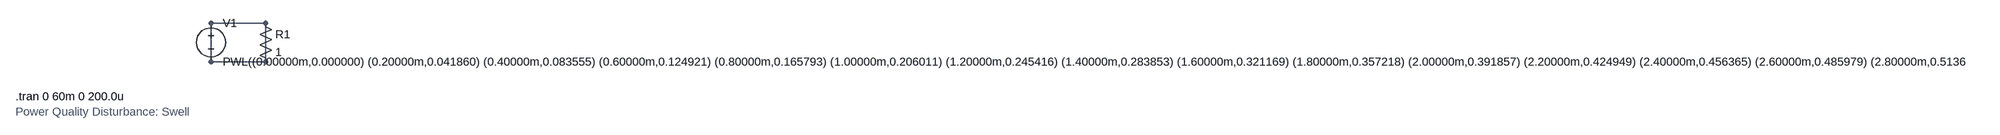
[diagram p0: schematic Swell.asc]
Swell.asc, the LTspice schematic file:
Version 4
SHEET 1 880 680
WIRE 192 128 80 128
WIRE 80 128 80 208
WIRE 192 208 80 208
WIRE 192 128 192 208
SYMBOL voltage 80 112 R0
WINDOW 123 0 0 Left 0
WINDOW 39 0 0 Left 0
SYMATTR InstName V1
SYMATTR Value PWL((0.00000m,0.000000) (0.20000m,0.041860) (0.40000m,0.083555) (0.60000m,0.124921) (0.80000m,0.165793) (1.00000m,0.206011) (1.20000m,0.245416) (1.40000m,0.283853) (1.60000m,0.321169) (1.80000m,0.357218) (2.00000m,0.391857) (2.20000m,0.424949) (2.40000m,0.456365) (2.60000m,0.485979) (2.80000m,0.513675) (3.00000m,0.539345) (3.20000m,0.562885) (3.40000m,0.584204) (3.60000m,0.603218) (3.80000m,0.619851) (4.00000m,0.634038) (4.20000m,0.645722) (4.40000m,0.654858) (4.60000m,0.661410) (4.80000m,0.665351) (5.00000m,0.666667) (5.20000m,0.665351) (5.40000m,0.661410) (5.60000m,0.654858) (5.80000m,0.645722) (6.00000m,0.634038) (6.20000m,0.619851) (6.40000m,0.603218) (6.60000m,0.584204) (6.80000m,0.562885) (7.00000m,0.539345) (7.20000m,0.513675) (7.40000m,0.485979) (7.60000m,0.456365) (7.80000m,0.424949) (8.00000m,0.391857) (8.20000m,0.357218) (8.40000m,0.321169) (8.60000m,0.283853) (8.80000m,0.245416) (9.00000m,0.206011) (9.20000m,0.165793) (9.40000m,0.124921) (9.60000m,0.083555) (9.80000m,0.041860) (10.00000m,0.000000) (10.20000m,-0.041860) (10.40000m,-0.083555) (10.60000m,-0.124921) (10.80000m,-0.165793) (11.00000m,-0.206011) (11.20000m,-0.245416) (11.40000m,-0.283853) (11.60000m,-0.321169) (11.80000m,-0.357218) (12.00000m,-0.391857) (12.20000m,-0.424949) (12.40000m,-0.456365) (12.60000m,-0.485979) (12.80000m,-0.513675) (13.00000m,-0.539345) (13.20000m,-0.562885) (13.40000m,-0.584204) (13.60000m,-0.603218) (13.80000m,-0.619851) (14.00000m,-0.634038) (14.20000m,-0.645722) (14.40000m,-0.654858) (14.60000m,-0.661410) (14.80000m,-0.665351) (15.00000m,-0.666667) (15.20000m,-0.665351) (15.40000m,-0.661410) (15.60000m,-0.654858) (15.80000m,-0.645722) (16.00000m,-0.634038) (16.20000m,-0.619851) (16.40000m,-0.603218) (16.60000m,-0.584204) (16.80000m,-0.562885) (17.00000m,-0.539345) (17.20000m,-0.513675) (17.40000m,-0.485979) (17.60000m,-0.456365) (17.80000m,-0.424949) (18.00000m,-0.391857) (18.20000m,-0.357218) (18.40000m,-0.321169) (18.60000m,-0.283853) (18.80000m,-0.245416) (19.00000m,-0.206011) (19.20000m,-0.165793) (19.40000m,-0.124921) (19.60000m,-0.083555) (19.80000m,-0.041860) (20.00000m,-0.000000) (20.20000m,0.062791) (20.40000m,0.125333) (20.60000m,0.187381) (20.80000m,0.248690) (21.00000m,0.309017) (21.20000m,0.368125) (21.40000m,0.425779) (21.60000m,0.481754) (21.80000m,0.535827) (22.00000m,0.587785) (22.20000m,0.637424) (22.40000m,0.684547) (22.60000m,0.728969) (22.80000m,0.770513) (23.00000m,0.809017) (23.20000m,0.844328) (23.40000m,0.876307) (23.60000m,0.904827) (23.80000m,0.929776) (24.00000m,0.951057) (24.20000m,0.968583) (24.40000m,0.982287) (24.60000m,0.992115) (24.80000m,0.998027) (25.00000m,1.000000) (25.20000m,0.998027) (25.40000m,0.992115) (25.60000m,0.982287) (25.80000m,0.968583) (26.00000m,0.951057) (26.20000m,0.929776) (26.40000m,0.904827) (26.60000m,0.876307) (26.80000m,0.844328) (27.00000m,0.809017) (27.20000m,0.770513) (27.40000m,0.728969) (27.60000m,0.684547) (27.80000m,0.637424) (28.00000m,0.587785) (28.20000m,0.535827) (28.40000m,0.481754) (28.60000m,0.425779) (28.80000m,0.368125) (29.00000m,0.309017) (29.20000m,0.248690) (29.40000m,0.187381) (29.60000m,0.125333) (29.80000m,0.062791) (30.00000m,0.000000) (30.20000m,-0.062791) (30.40000m,-0.125333) (30.60000m,-0.187381) (30.80000m,-0.248690) (31.00000m,-0.309017) (31.20000m,-0.368125) (31.40000m,-0.425779) (31.60000m,-0.481754) (31.80000m,-0.535827) (32.00000m,-0.587785) (32.20000m,-0.637424) (32.40000m,-0.684547) (32.60000m,-0.728969) (32.80000m,-0.770513) (33.00000m,-0.809017) (33.20000m,-0.844328) (33.40000m,-0.876307) (33.60000m,-0.904827) (33.80000m,-0.929776) (34.00000m,-0.951057) (34.20000m,-0.968583) (34.40000m,-0.982287) (34.60000m,-0.992115) (34.80000m,-0.998027) (35.00000m,-1.000000) (35.20000m,-0.998027) (35.40000m,-0.992115) (35.60000m,-0.982287) (35.80000m,-0.968583) (36.00000m,-0.951057) (36.20000m,-0.929776) (36.40000m,-0.904827) (36.60000m,-0.876307) (36.80000m,-0.844328) (37.00000m,-0.809017) (37.20000m,-0.770513) (37.40000m,-0.728969) (37.60000m,-0.684547) (37.80000m,-0.637424) (38.00000m,-0.587785) (38.20000m,-0.535827) (38.40000m,-0.481754) (38.60000m,-0.425779) (38.80000m,-0.368125) (39.00000m,-0.309017) (39.20000m,-0.248690) (39.40000m,-0.187381) (39.60000m,-0.125333) (39.80000m,-0.062791) (40.00000m,-0.000000) (40.20000m,0.041860) (40.40000m,0.083555) (40.60000m,0.124921) (40.80000m,0.165793) (41.00000m,0.206011) (41.20000m,0.245416) (41.40000m,0.283853) (41.60000m,0.321169) (41.80000m,0.357218) (42.00000m,0.391857) (42.20000m,0.424949) (42.40000m,0.456365) (42.60000m,0.485979) (42.80000m,0.513675) (43.00000m,0.539345) (43.20000m,0.562885) (43.40000m,0.584204) (43.60000m,0.603218) (43.80000m,0.619851) (44.00000m,0.634038) (44.20000m,0.645722) (44.40000m,0.654858) (44.60000m,0.661410) (44.80000m,0.665351) (45.00000m,0.666667) (45.20000m,0.665351) (45.40000m,0.661410) (45.60000m,0.654858) (45.80000m,0.645722) (46.00000m,0.634038) (46.20000m,0.619851) (46.40000m,0.603218) (46.60000m,0.584204) (46.80000m,0.562885) (47.00000m,0.539345) (47.20000m,0.513675) (47.40000m,0.485979) (47.60000m,0.456365) (47.80000m,0.424949) (48.00000m,0.391857) (48.20000m,0.357218) (48.40000m,0.321169) (48.60000m,0.283853) (48.80000m,0.245416) (49.00000m,0.206011) (49.20000m,0.165793) (49.40000m,0.124921) (49.60000m,0.083555) (49.80000m,0.041860) (50.00000m,0.000000) (50.20000m,-0.041860) (50.40000m,-0.083555) (50.60000m,-0.124921) (50.80000m,-0.165793) (51.00000m,-0.206011) (51.20000m,-0.245416) (51.40000m,-0.283853) (51.60000m,-0.321169) (51.80000m,-0.357218) (52.00000m,-0.391857) (52.20000m,-0.424949) (52.40000m,-0.456365) (52.60000m,-0.485979) (52.80000m,-0.513675) (53.00000m,-0.539345) (53.20000m,-0.562885) (53.40000m,-0.584204) (53.60000m,-0.603218) (53.80000m,-0.619851) (54.00000m,-0.634038) (54.20000m,-0.645722) (54.40000m,-0.654858) (54.60000m,-0.661410) (54.80000m,-0.665351) (55.00000m,-0.666667) (55.20000m,-0.665351) (55.40000m,-0.661410) (55.60000m,-0.654858) (55.80000m,-0.645722) (56.00000m,-0.634038) (56.20000m,-0.619851) (56.40000m,-0.603218) (56.60000m,-0.584204) (56.80000m,-0.562885) (57.00000m,-0.539345) (57.20000m,-0.513675) (57.40000m,-0.485979) (57.60000m,-0.456365) (57.80000m,-0.424949) (58.00000m,-0.391857) (58.20000m,-0.357218) (58.40000m,-0.321169) (58.60000m,-0.283853) (58.80000m,-0.245416) (59.00000m,-0.206011) (59.20000m,-0.165793) (59.40000m,-0.124921) (59.60000m,-0.083555) (59.80000m,-0.041860))
SYMBOL res 176 112 R0
SYMATTR InstName R1
SYMATTR Value 1
TEXT -320 280 Left 2 !.tran 0 60m 0 200.0u
TEXT -320 312 Left 2 ;Power Quality Disturbance: Swell

The netlist it stands for:
* Swell.asc
V1 N001 N001 PWL((0.00000m,0.000000) (0.20000m,0.041860) (0.40000m,0.083555) (0.60000m,0.124921) (0.80000m,0.165793) (1.00000m,0.206011) (1.20000m,0.245416) (1.40000m,0.283853) (1.60000m,0.321169) (1.80000m,0.357218) (2.00000m,0.391857) (2.20000m,0.424949) (2.40000m,0.456365) (2.60000m,0.485979) (2.80000m,0.513675) (3.00000m,0.539345) (3.20000m,0.562885) (3.40000m,0.584204) (3.60000m,0.603218) (3.80000m,0.619851) (4.00000m,0.634038) (4.20000m,0.645722) (4.40000m,0.654858) (4.60000m,0.661410) (4.80000m,0.665351) (5.00000m,0.666667) (5.20000m,0.665351) (5.40000m,0.661410) (5.60000m,0.654858) (5.80000m,0.645722) (6.00000m,0.634038) (6.20000m,0.619851) (6.40000m,0.603218) (6.60000m,0.584204) (6.80000m,0.562885) (7.00000m,0.539345) (7.20000m,0.513675) (7.40000m,0.485979) (7.60000m,0.456365) (7.80000m,0.424949) (8.00000m,0.391857) (8.20000m,0.357218) (8.40000m,0.321169) (8.60000m,0.283853) (8.80000m,0.245416) (9.00000m,0.206011) (9.20000m,0.165793) (9.40000m,0.124921) (9.60000m,0.083555) (9.80000m,0.041860) (10.00000m,0.000000) (10.20000m,-0.041860) (10.40000m,-0.083555) (10.60000m,-0.124921) (10.80000m,-0.165793) (11.00000m,-0.206011) (11.20000m,-0.245416) (11.40000m,-0.283853) (11.60000m,-0.321169) (11.80000m,-0.357218) (12.00000m,-0.391857) (12.20000m,-0.424949) (12.40000m,-0.456365) (12.60000m,-0.485979) (12.80000m,-0.513675) (13.00000m,-0.539345) (13.20000m,-0.562885) (13.40000m,-0.584204) (13.60000m,-0.603218) (13.80000m,-0.619851) (14.00000m,-0.634038) (14.20000m,-0.645722) (14.40000m,-0.654858) (14.60000m,-0.661410) (14.80000m,-0.665351) (15.00000m,-0.666667) (15.20000m,-0.665351) (15.40000m,-0.661410) (15.60000m,-0.654858) (15.80000m,-0.645722) (16.00000m,-0.634038) (16.20000m,-0.619851) (16.40000m,-0.603218) (16.60000m,-0.584204) (16.80000m,-0.562885) (17.00000m,-0.539345) (17.20000m,-0.513675) (17.40000m,-0.485979) (17.60000m,-0.456365) (17.80000m,-0.424949) (18.00000m,-0.391857) (18.20000m,-0.357218) (18.40000m,-0.321169) (18.60000m,-0.283853) (18.80000m,-0.245416) (19.00000m,-0.206011) (19.20000m,-0.165793) (19.40000m,-0.124921) (19.60000m,-0.083555) (19.80000m,-0.041860) (20.00000m,-0.000000) (20.20000m,0.062791) (20.40000m,0.125333) (20.60000m,0.187381) (20.80000m,0.248690) (21.00000m,0.309017) (21.20000m,0.368125) (21.40000m,0.425779) (21.60000m,0.481754) (21.80000m,0.535827) (22.00000m,0.587785) (22.20000m,0.637424) (22.40000m,0.684547) (22.60000m,0.728969) (22.80000m,0.770513) (23.00000m,0.809017) (23.20000m,0.844328) (23.40000m,0.876307) (23.60000m,0.904827) (23.80000m,0.929776) (24.00000m,0.951057) (24.20000m,0.968583) (24.40000m,0.982287) (24.60000m,0.992115) (24.80000m,0.998027) (25.00000m,1.000000) (25.20000m,0.998027) (25.40000m,0.992115) (25.60000m,0.982287) (25.80000m,0.968583) (26.00000m,0.951057) (26.20000m,0.929776) (26.40000m,0.904827) (26.60000m,0.876307) (26.80000m,0.844328) (27.00000m,0.809017) (27.20000m,0.770513) (27.40000m,0.728969) (27.60000m,0.684547) (27.80000m,0.637424) (28.00000m,0.587785) (28.20000m,0.535827) (28.40000m,0.481754) (28.60000m,0.425779) (28.80000m,0.368125) (29.00000m,0.309017) (29.20000m,0.248690) (29.40000m,0.187381) (29.60000m,0.125333) (29.80000m,0.062791) (30.00000m,0.000000) (30.20000m,-0.062791) (30.40000m,-0.125333) (30.60000m,-0.187381) (30.80000m,-0.248690) (31.00000m,-0.309017) (31.20000m,-0.368125) (31.40000m,-0.425779) (31.60000m,-0.481754) (31.80000m,-0.535827) (32.00000m,-0.587785) (32.20000m,-0.637424) (32.40000m,-0.684547) (32.60000m,-0.728969) (32.80000m,-0.770513) (33.00000m,-0.809017) (33.20000m,-0.844328) (33.40000m,-0.876307) (33.60000m,-0.904827) (33.80000m,-0.929776) (34.00000m,-0.951057) (34.20000m,-0.968583) (34.40000m,-0.982287) (34.60000m,-0.992115) (34.80000m,-0.998027) (35.00000m,-1.000000) (35.20000m,-0.998027) (35.40000m,-0.992115) (35.60000m,-0.982287) (35.80000m,-0.968583) (36.00000m,-0.951057) (36.20000m,-0.929776) (36.40000m,-0.904827) (36.60000m,-0.876307) (36.80000m,-0.844328) (37.00000m,-0.809017) (37.20000m,-0.770513) (37.40000m,-0.728969) (37.60000m,-0.684547) (37.80000m,-0.637424) (38.00000m,-0.587785) (38.20000m,-0.535827) (38.40000m,-0.481754) (38.60000m,-0.425779) (38.80000m,-0.368125) (39.00000m,-0.309017) (39.20000m,-0.248690) (39.40000m,-0.187381) (39.60000m,-0.125333) (39.80000m,-0.062791) (40.00000m,-0.000000) (40.20000m,0.041860) (40.40000m,0.083555) (40.60000m,0.124921) (40.80000m,0.165793) (41.00000m,0.206011) (41.20000m,0.245416) (41.40000m,0.283853) (41.60000m,0.321169) (41.80000m,0.357218) (42.00000m,0.391857) (42.20000m,0.424949) (42.40000m,0.456365) (42.60000m,0.485979) (42.80000m,0.513675) (43.00000m,0.539345) (43.20000m,0.562885) (43.40000m,0.584204) (43.60000m,0.603218) (43.80000m,0.619851) (44.00000m,0.634038) (44.20000m,0.645722) (44.40000m,0.654858) (44.60000m,0.661410) (44.80000m,0.665351) (45.00000m,0.666667) (45.20000m,0.665351) (45.40000m,0.661410) (45.60000m,0.654858) (45.80000m,0.645722) (46.00000m,0.634038) (46.20000m,0.619851) (46.40000m,0.603218) (46.60000m,0.584204) (46.80000m,0.562885) (47.00000m,0.539345) (47.20000m,0.513675) (47.40000m,0.485979) (47.60000m,0.456365) (47.80000m,0.424949) (48.00000m,0.391857) (48.20000m,0.357218) (48.40000m,0.321169) (48.60000m,0.283853) (48.80000m,0.245416) (49.00000m,0.206011) (49.20000m,0.165793) (49.40000m,0.124921) (49.60000m,0.083555) (49.80000m,0.041860) (50.00000m,0.000000) (50.20000m,-0.041860) (50.40000m,-0.083555) (50.60000m,-0.124921) (50.80000m,-0.165793) (51.00000m,-0.206011) (51.20000m,-0.245416) (51.40000m,-0.283853) (51.60000m,-0.321169) (51.80000m,-0.357218) (52.00000m,-0.391857) (52.20000m,-0.424949) (52.40000m,-0.456365) (52.60000m,-0.485979) (52.80000m,-0.513675) (53.00000m,-0.539345) (53.20000m,-0.562885) (53.40000m,-0.584204) (53.60000m,-0.603218) (53.80000m,-0.619851) (54.00000m,-0.634038) (54.20000m,-0.645722) (54.40000m,-0.654858) (54.60000m,-0.661410) (54.80000m,-0.665351) (55.00000m,-0.666667) (55.20000m,-0.665351) (55.40000m,-0.661410) (55.60000m,-0.654858) (55.80000m,-0.645722) (56.00000m,-0.634038) (56.20000m,-0.619851) (56.40000m,-0.603218) (56.60000m,-0.584204) (56.80000m,-0.562885) (57.00000m,-0.539345) (57.20000m,-0.513675) (57.40000m,-0.485979) (57.60000m,-0.456365) (57.80000m,-0.424949) (58.00000m,-0.391857) (58.20000m,-0.357218) (58.40000m,-0.321169) (58.60000m,-0.283853) (58.80000m,-0.245416) (59.00000m,-0.206011) (59.20000m,-0.165793) (59.40000m,-0.124921) (59.60000m,-0.083555) (59.80000m,-0.041860))
R1 N001 N001 1
.tran 0 60m 0 200.0u
* Power Quality Disturbance: Swell
.backanno
.end